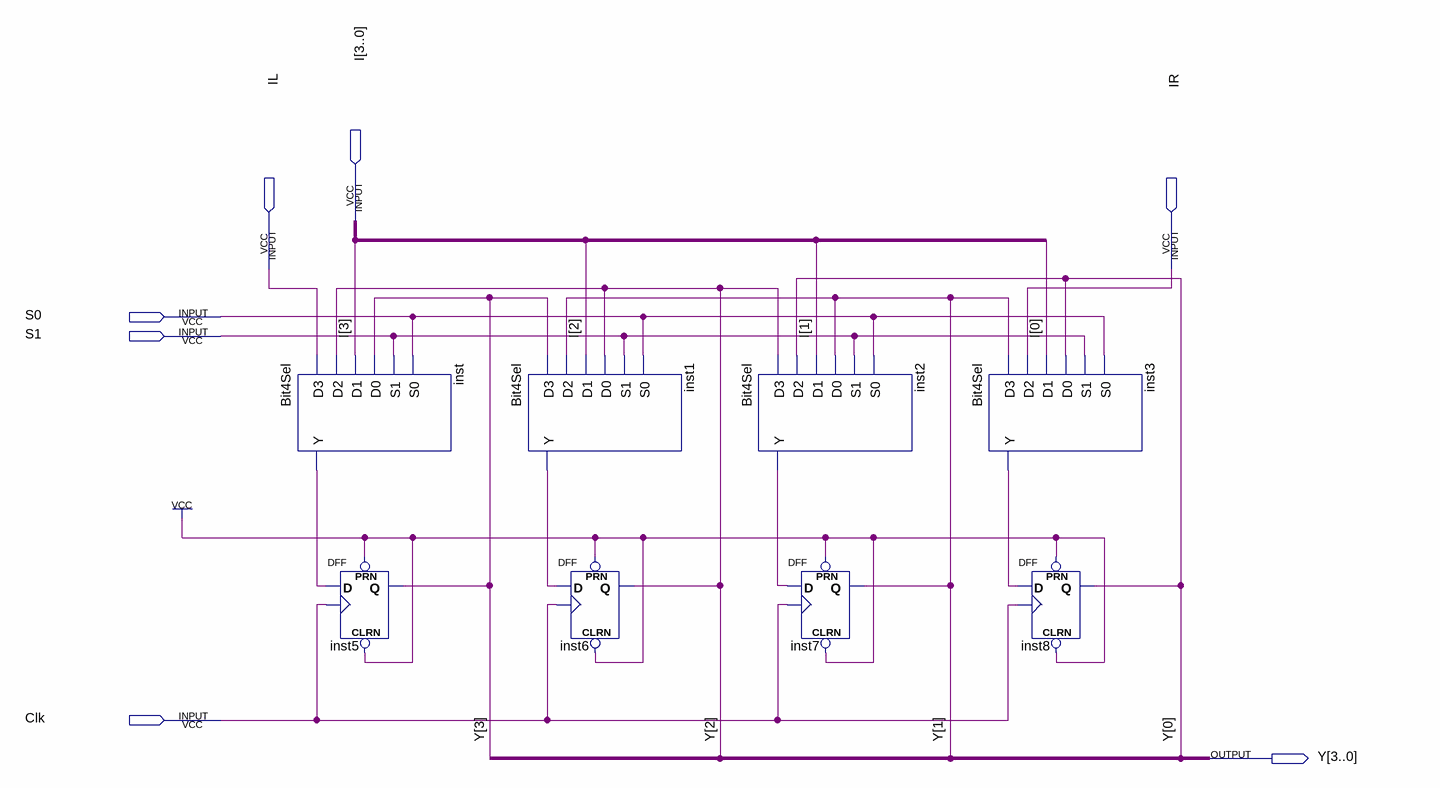
[diagram p0: schematic sheet]
// Quartus schematic Accumulator.bdf as structural Verilog: 8 symbols, 7 pins
module Accumulator (
  input  [3:0] I,
  input  IL,
  input  IR,
  input  S0,
  input  S1,
  input  Clk,
  output [3:0] Y
);

  wire inst1_y, inst2_y, inst3_y, inst_y;

  Bit4Sel inst (.D3(IL), .D2(Y[2]), .D1(I[3]), .D0(Y[3]), .S1(S1), .S0(S0), .Y(inst_y));
  DFF inst5 (.CLRN(1'b1), .CLK(Clk), .D(inst_y), .PRN(1'b1), .Q(Y[3]));
  Bit4Sel inst1 (.D3(Y[3]), .D2(Y[1]), .D1(I[2]), .D0(Y[2]), .S1(S1), .S0(S0), .Y(inst1_y));
  DFF inst6 (.CLRN(1'b1), .CLK(Clk), .D(inst1_y), .PRN(1'b1), .Q(Y[2]));
  Bit4Sel inst2 (.D3(Y[2]), .D2(Y[0]), .D1(I[1]), .D0(Y[1]), .S1(S1), .S0(S0), .Y(inst2_y));
  DFF inst7 (.CLRN(1'b1), .CLK(Clk), .D(inst2_y), .PRN(1'b1), .Q(Y[1]));
  Bit4Sel inst3 (.D3(Y[1]), .D2(IR), .D1(I[0]), .D0(Y[0]), .S1(S1), .S0(S0), .Y(inst3_y));
  DFF inst8 (.CLRN(1'b1), .CLK(Clk), .D(inst3_y), .PRN(1'b1), .Q(Y[0]));
endmodule
